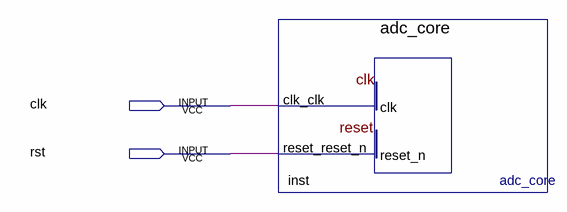
[diagram p0: schematic sheet]
// Quartus schematic analog_to_digital.bdf as structural Verilog: 1 symbols, 2 pins
module analog_to_digital (
  input  clk,
  input  rst
);

  adc_core inst (.clk_clk(clk), .reset_reset_n(rst));
endmodule
